# Altium schematic sheet Sheet.SchDoc
size A2
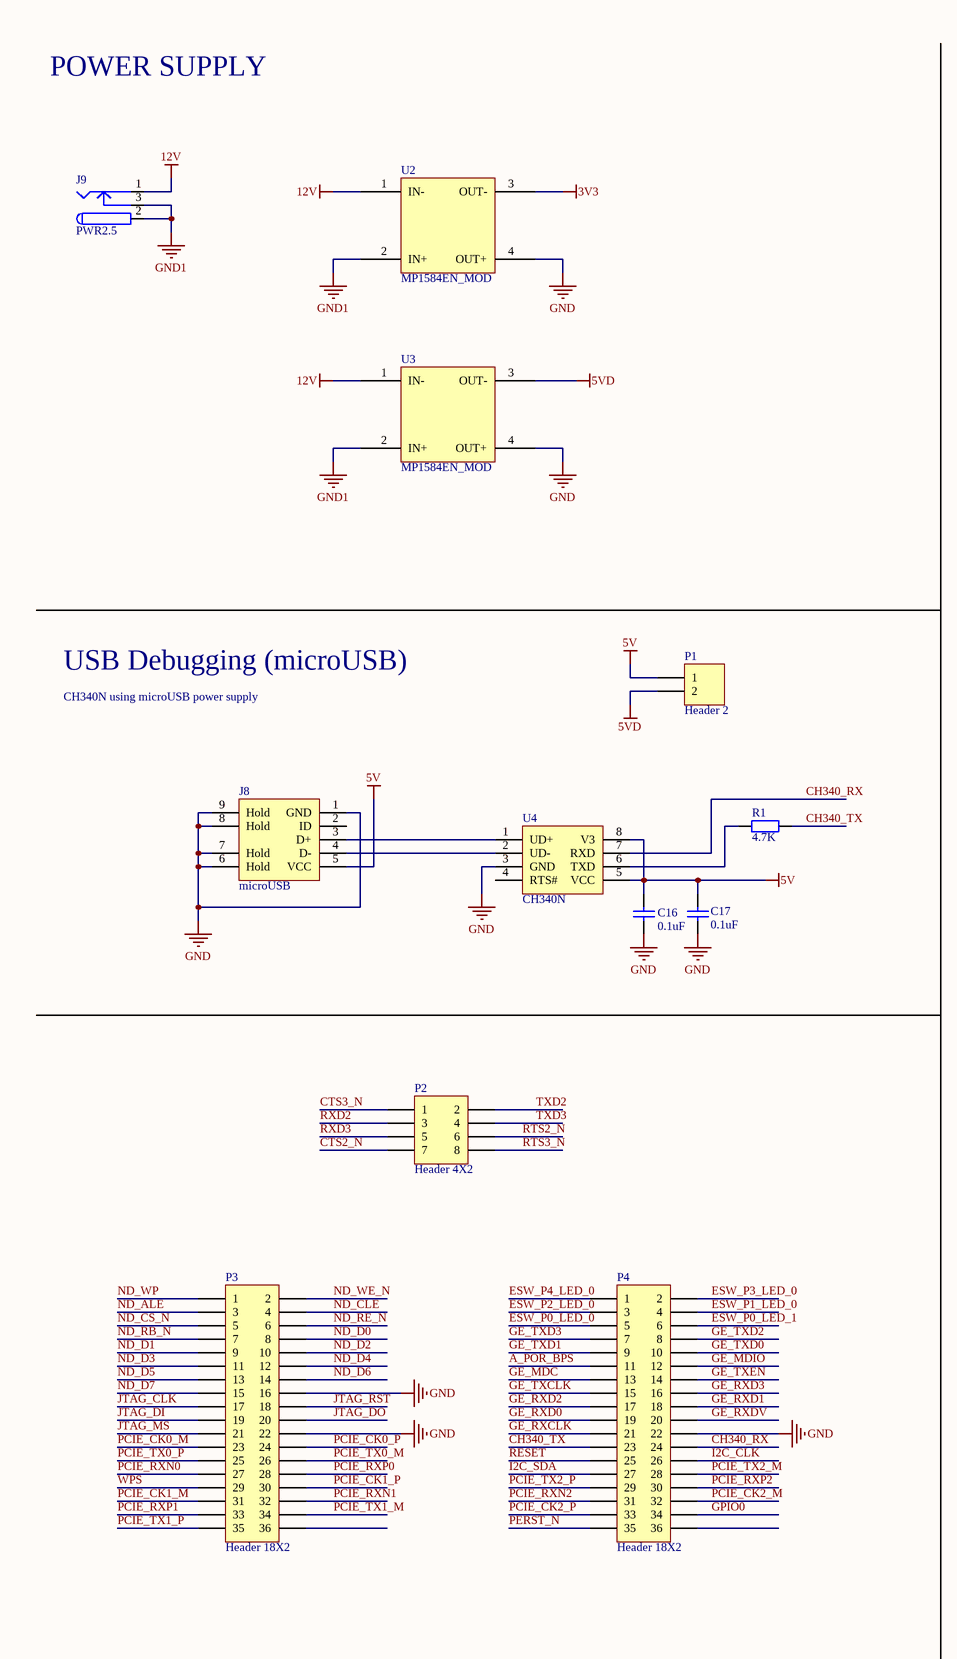
[diagram p0: Sheet.SchDoc, left]
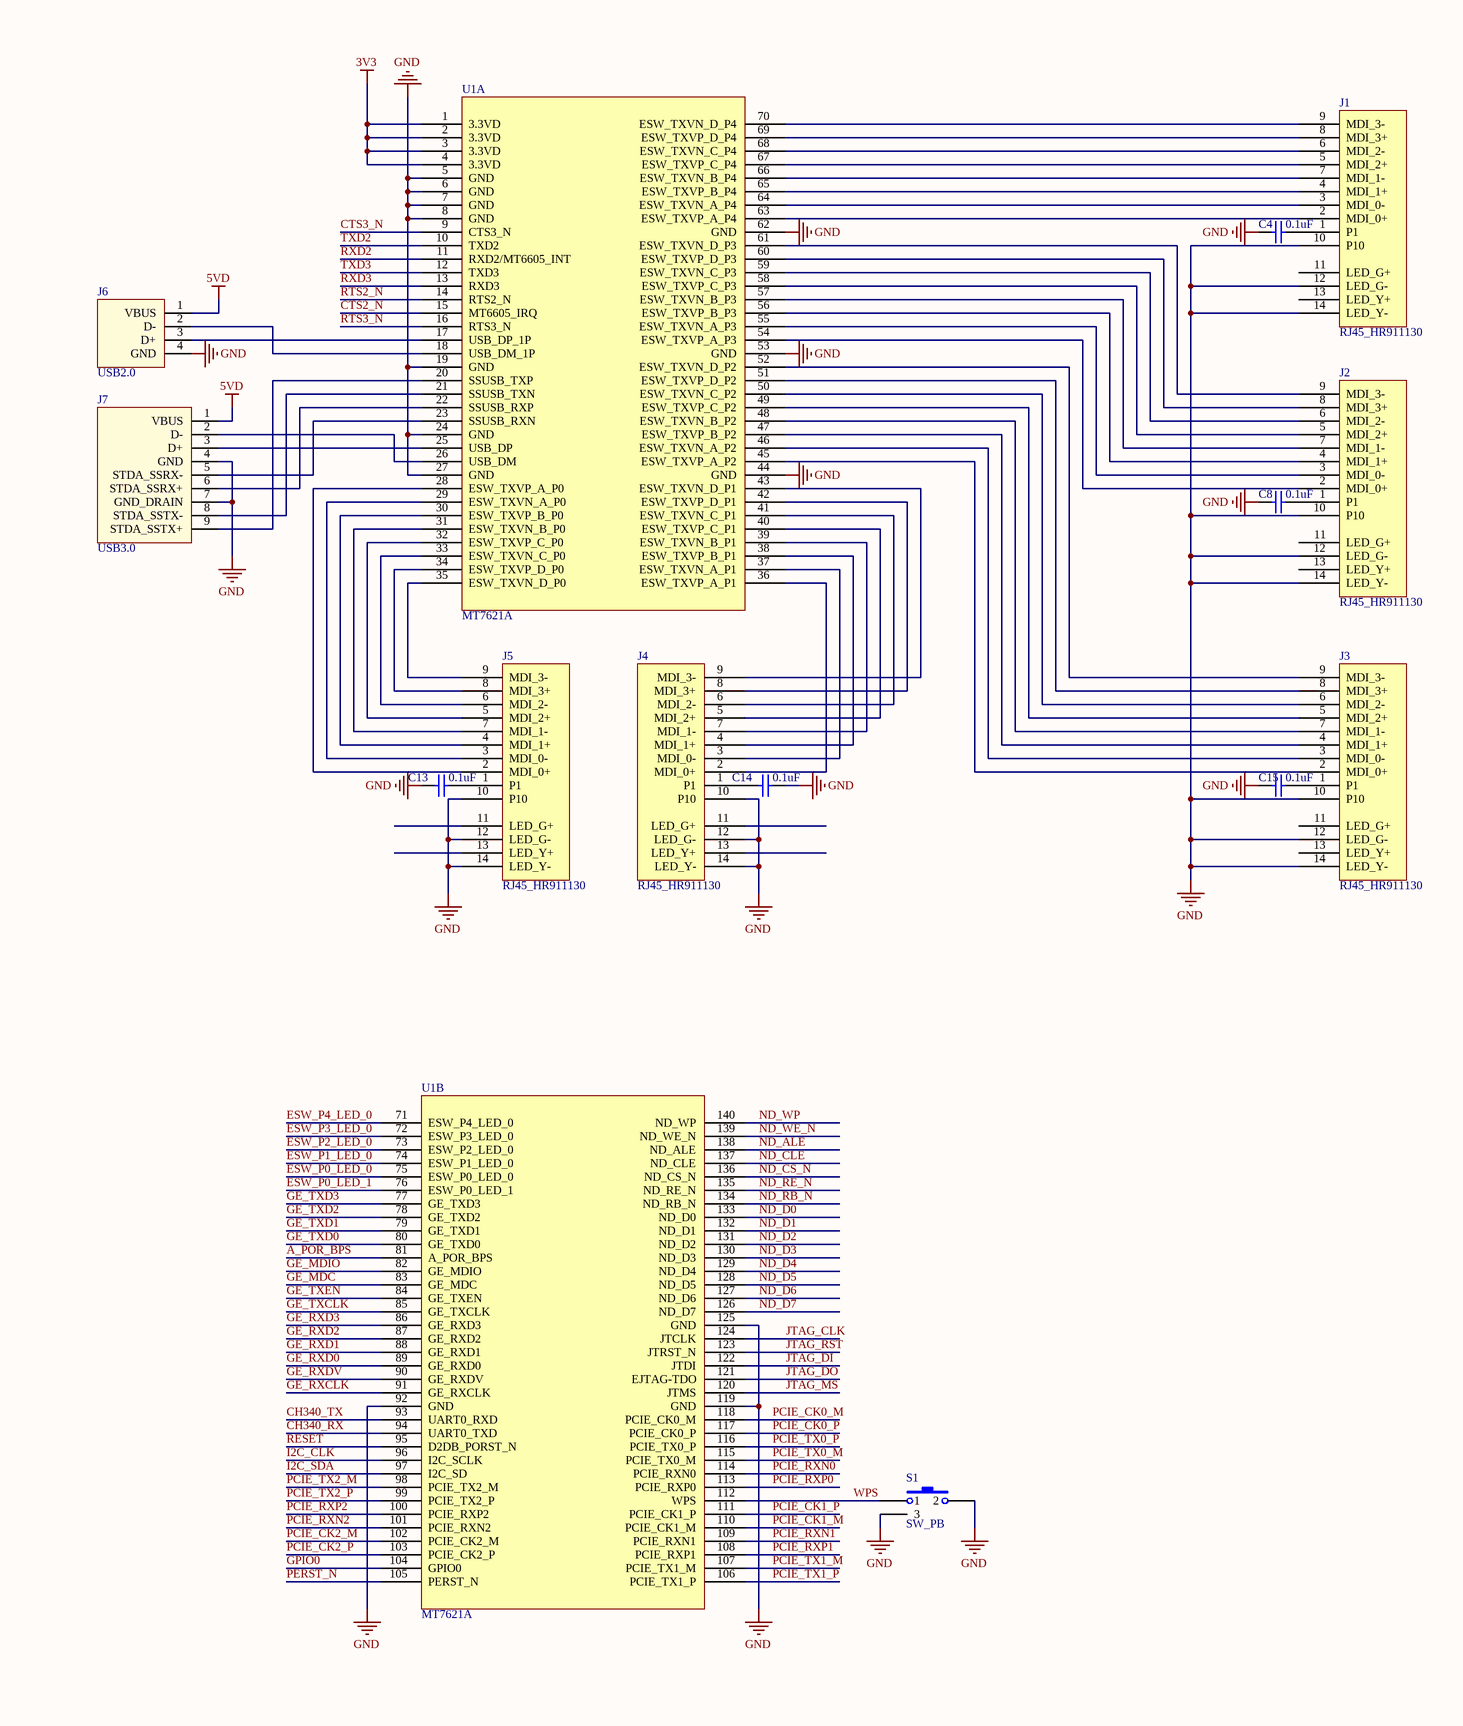
[diagram p1: Sheet.SchDoc, right]

## Parts
C4  value 0.1uF  [C0603]  (hidden comment: Cap)
C8  value 0.1uF  [C0603]  (hidden comment: Cap)
C13  value 0.1uF  [C0603]  (hidden comment: Cap)
C14  value 0.1uF  [C0603]  (hidden comment: Cap)
C15  value 0.1uF  [C0603]  (hidden comment: Cap)
C16  value 0.1uF  [C0603]  (hidden comment: Cap)
C17  value 0.1uF  [C0603]  (hidden comment: Cap)
J1  RJ45_HR911130  [RJ45_HR911130]
J2  RJ45_HR911130  [RJ45_HR911130]
J3  RJ45_HR911130  [RJ45_HR911130]
J4  RJ45_HR911130  [RJ45_HR911130]
J5  RJ45_HR911130  [RJ45_HR911130]
J6  USB2.0  [USB2.0]
J7  USB3.0  [USB3.0]
J8  microUSB  [MICROusb]
J9  PWR2.5  [CON\DC-JACK\4.7]
P1  Header 2  [HDR1X2]
P2  Header 4X2  [HDR2X4]
P3  Header 18X2  [HDR2X18]
P4  Header 18X2  [HDR2X18]
R1  value 4.7K  [3-0603]  (hidden comment: Res2)
S1  SW_PB  [SW_PB]
U1  MT7621A  [HLK-7621]  (parts A,B of 2)
U2  MP1584EN_MOD  [MP1584EN_MOD]
U3  MP1584EN_MOD  [MP1584EN_MOD]
U4  CH340N  [CH340N]

## Nets
3V3: U1.1(3.3VD) U1.2(3.3VD) U1.3(3.3VD) U1.4(3.3VD) U2.3(OUT-)
5V: C16.2 C17.1 J8.5(VCC) P1.1 U4.5(VCC) U4.8(V3)
5VD: J6.1(VBUS) J7.1(VBUS) P1.2 U3.3(OUT-)
12V: J9.1 U2.1(IN-) U3.1(IN-)
GND: C4.2 C8.2 C13.2 C14.1 C15.2 C16.1 C17.2 J1.10(P10) J1.12(LED_G-) J1.14(LED_Y-) J2.10(P10) J2.12(LED_G-) J2.14(LED_Y-) J3.10(P10) J3.12(LED_G-) J3.14(LED_Y-) J4.10(P10) J4.12(LED_G-) J4.14(LED_Y-) J5.10(P10) J5.12(LED_G-) J5.14(LED_Y-) J6.4(GND) J7.4(GND) J7.7(GND_DRAIN) J8.1(GND) J8.6(Hold) J8.7(Hold) J8.8(Hold) J8.9(Hold) P3.16 P3.22 P4.22 S1.2 S1.3 U1.5(GND) U1.6(GND) U1.7(GND) U1.8(GND) U1.19(GND) U1.24(GND) U1.27(GND) U1.44(GND) U1.53(GND) U1.62(GND) U1.92(GND) U1.119(GND) U1.125(GND) U2.4(OUT+) U3.4(OUT+) U4.3(GND)
GND1: J9.2 J9.3 U2.2(IN+) U3.2(IN+)
A_POR_BPS: P4.11 U1.81(A_POR_BPS)
CH340_RX: P4.24 U1.94(UART0_TXD) U4.7(RXD)
CH340_TX: P4.23 R1.1 U1.93(UART0_RXD)
CTS2_N: P2.7 U1.15(MT6605_IRQ)
CTS3_N: P2.1 U1.9(CTS3_N)
ESW_P0_LED_0: P4.5 U1.75(ESW_P0_LED_0)
ESW_P0_LED_1: P4.6 U1.76(ESW_P0_LED_1)
ESW_P1_LED_0: P4.4 U1.74(ESW_P1_LED_0)
ESW_P2_LED_0: P4.3 U1.73(ESW_P2_LED_0)
ESW_P3_LED_0: P4.2 U1.72(ESW_P3_LED_0)
ESW_P4_LED_0: P4.1 U1.71(ESW_P4_LED_0)
GE_MDC: P4.13 U1.83(GE_MDC)
GE_MDIO: P4.12 U1.82(GE_MDIO)
GE_RXCLK: P4.21 U1.91(GE_RXCLK)
GE_RXD0: P4.19 U1.89(GE_RXD0)
GE_RXD1: P4.18 U1.88(GE_RXD1)
GE_RXD2: P4.17 U1.87(GE_RXD2)
GE_RXD3: P4.16 U1.86(GE_RXD3)
GE_RXDV: P4.20 U1.90(GE_RXDV)
GE_TXCLK: P4.15 U1.85(GE_TXCLK)
GE_TXD0: P4.10 U1.80(GE_TXD0)
GE_TXD1: P4.9 U1.79(GE_TXD1)
GE_TXD2: P4.8 U1.78(GE_TXD2)
GE_TXD3: P4.7 U1.77(GE_TXD3)
GE_TXEN: P4.14 U1.84(GE_TXEN)
GPIO0: P4.34 U1.104(GPIO0)
I2C_CLK: P4.26 U1.96(I2C_SCLK)
I2C_SDA: P4.27 U1.97(I2C_SD)
JTAG_CLK: P3.17 U1.124(JTCLK)
JTAG_DI: P3.19 U1.122(JTDI)
JTAG_DO: P3.20 U1.121(EJTAG-TDO)
JTAG_MS: P3.21 U1.120(JTMS)
JTAG_RST: P3.18 U1.123(JTRST_N)
ND_ALE: P3.3 U1.138(ND_ALE)
ND_CLE: P3.4 U1.137(ND_CLE)
ND_CS_N: P3.5 U1.136(ND_CS_N)
ND_D0: P3.8 U1.133(ND_D0)
ND_D1: P3.9 U1.132(ND_D1)
ND_D2: P3.10 U1.131(ND_D2)
ND_D3: P3.11 U1.130(ND_D3)
ND_D4: P3.12 U1.129(ND_D4)
ND_D5: P3.13 U1.128(ND_D5)
ND_D6: P3.14 U1.127(ND_D6)
ND_D7: P3.15 U1.126(ND_D7)
ND_RB_N: P3.7 U1.134(ND_RB_N)
ND_RE_N: P3.6 U1.135(ND_RE_N)
ND_WE_N: P3.2 U1.139(ND_WE_N)
ND_WP: P3.1 U1.140(ND_WP)
PCIE_CK0_M: P3.23 U1.118(PCIE_CK0_M)
PCIE_CK0_P: P3.24 U1.117(PCIE_CK0_P)
PCIE_CK1_M: P3.31 U1.110(PCIE_CK1_M)
PCIE_CK1_P: P3.30 U1.111(PCIE_CK1_P)
PCIE_CK2_M: P4.32 U1.102(PCIE_CK2_M)
PCIE_CK2_P: P4.33 U1.103(PCIE_CK2_P)
PCIE_RXN0: P3.27 U1.114(PCIE_RXN0)
PCIE_RXN1: P3.32 U1.109(PCIE_RXN1)
PCIE_RXN2: P4.31 U1.101(PCIE_RXN2)
PCIE_RXP0: P3.28 U1.113(PCIE_RXP0)
PCIE_RXP1: P3.33 U1.108(PCIE_RXP1)
PCIE_RXP2: P4.30 U1.100(PCIE_RXP2)
PCIE_TX0_M: P3.26 U1.115(PCIE_TX0_M)
PCIE_TX0_P: P3.25 U1.116(PCIE_TX0_P)
PCIE_TX1_M: P3.34 U1.107(PCIE_TX1_M)
PCIE_TX1_P: P3.35 U1.106(PCIE_TX1_P)
PCIE_TX2_M: P4.28 U1.98(PCIE_TX2_M)
PCIE_TX2_P: P4.29 U1.99(PCIE_TX2_P)
PERST_N: P4.35 U1.105(PERST_N)
RESET: P4.25 U1.95(D2DB_PORST_N)
RTS2_N: P2.6 U1.14(RTS2_N)
RTS3_N: P2.8 U1.16(RTS3_N)
RXD2: P2.3 U1.11(RXD2/MT6605_INT)
RXD3: P2.5 U1.13(RXD3)
TXD2: P2.2 U1.10(TXD2)
TXD3: P2.4 U1.12(TXD3)
WPS: P3.29 S1.1 U1.112(WPS)
NetC4_1: C4.1 J1.1(P1)
NetC8_1: C8.1 J2.1(P1)
NetC13_1: C13.1 J5.1(P1)
NetC14_2: C14.2 J4.1(P1)
NetC15_1: C15.1 J3.1(P1)
NetJ1_2: J1.2(MDI_0+) U1.63(ESW_TXVP_A_P4)
NetJ1_3: J1.3(MDI_0-) U1.64(ESW_TXVN_A_P4)
NetJ1_4: J1.4(MDI_1+) U1.65(ESW_TXVP_B_P4)
NetJ1_5: J1.5(MDI_2+) U1.67(ESW_TXVP_C_P4)
NetJ1_6: J1.6(MDI_2-) U1.68(ESW_TXVN_C_P4)
NetJ1_7: J1.7(MDI_1-) U1.66(ESW_TXVN_B_P4)
NetJ1_8: J1.8(MDI_3+) U1.69(ESW_TXVP_D_P4)
NetJ1_9: J1.9(MDI_3-) U1.70(ESW_TXVN_D_P4)
NetJ2_2: J2.2(MDI_0+) U1.54(ESW_TXVP_A_P3)
NetJ2_3: J2.3(MDI_0-) U1.55(ESW_TXVN_A_P3)
NetJ2_4: J2.4(MDI_1+) U1.56(ESW_TXVP_B_P3)
NetJ2_5: J2.5(MDI_2+) U1.58(ESW_TXVP_C_P3)
NetJ2_6: J2.6(MDI_2-) U1.59(ESW_TXVN_C_P3)
NetJ2_7: J2.7(MDI_1-) U1.57(ESW_TXVN_B_P3)
NetJ2_8: J2.8(MDI_3+) U1.60(ESW_TXVP_D_P3)
NetJ2_9: J2.9(MDI_3-) U1.61(ESW_TXVN_D_P3)
NetJ3_2: J3.2(MDI_0+) U1.45(ESW_TXVP_A_P2)
NetJ3_3: J3.3(MDI_0-) U1.46(ESW_TXVN_A_P2)
NetJ3_4: J3.4(MDI_1+) U1.47(ESW_TXVP_B_P2)
NetJ3_5: J3.5(MDI_2+) U1.49(ESW_TXVP_C_P2)
NetJ3_6: J3.6(MDI_2-) U1.50(ESW_TXVN_C_P2)
NetJ3_7: J3.7(MDI_1-) U1.48(ESW_TXVN_B_P2)
NetJ3_8: J3.8(MDI_3+) U1.51(ESW_TXVP_D_P2)
NetJ3_9: J3.9(MDI_3-) U1.52(ESW_TXVN_D_P2)
NetJ4_2: J4.2(MDI_0+) U1.36(ESW_TXVP_A_P1)
NetJ4_3: J4.3(MDI_0-) U1.37(ESW_TXVN_A_P1)
NetJ4_4: J4.4(MDI_1+) U1.38(ESW_TXVP_B_P1)
NetJ4_5: J4.5(MDI_2+) U1.40(ESW_TXVP_C_P1)
NetJ4_6: J4.6(MDI_2-) U1.41(ESW_TXVN_C_P1)
NetJ4_7: J4.7(MDI_1-) U1.39(ESW_TXVN_B_P1)
NetJ4_8: J4.8(MDI_3+) U1.42(ESW_TXVP_D_P1)
NetJ4_9: J4.9(MDI_3-) U1.43(ESW_TXVN_D_P1)
NetJ5_2: J5.2(MDI_0+) U1.28(ESW_TXVP_A_P0)
NetJ5_3: J5.3(MDI_0-) U1.29(ESW_TXVN_A_P0)
NetJ5_4: J5.4(MDI_1+) U1.30(ESW_TXVP_B_P0)
NetJ5_5: J5.5(MDI_2+) U1.32(ESW_TXVP_C_P0)
NetJ5_6: J5.6(MDI_2-) U1.33(ESW_TXVN_C_P0)
NetJ5_7: J5.7(MDI_1-) U1.31(ESW_TXVN_B_P0)
NetJ5_8: J5.8(MDI_3+) U1.34(ESW_TXVP_D_P0)
NetJ5_9: J5.9(MDI_3-) U1.35(ESW_TXVN_D_P0)
NetJ6_2: J6.2(D-) U1.18(USB_DM_1P)
NetJ6_3: J6.3(D+) U1.17(USB_DP_1P)
NetJ7_2: J7.2(D-) U1.26(USB_DM)
NetJ7_3: J7.3(D+) U1.25(USB_DP)
NetJ7_5: J7.5(STDA_SSRX-) U1.23(SSUSB_RXN)
NetJ7_6: J7.6(STDA_SSRX+) U1.22(SSUSB_RXP)
NetJ7_8: J7.8(STDA_SSTX-) U1.21(SSUSB_TXN)
NetJ7_9: J7.9(STDA_SSTX+) U1.20(SSUSB_TXP)
NetJ8_3: J8.3(D+) U4.1(UD+)
NetJ8_4: J8.4(D-) U4.2(UD-)
NetR1_2: R1.2 U4.6(TXD)

Not connected (* = marked no-connect by the designer): J1 11(LED_G+) 13(LED_Y+); J2 11(LED_G+) 13(LED_Y+); J3 11(LED_G+) 13(LED_Y+); J4 11(LED_G+) 13(LED_Y+); J5 11(LED_G+) 13(LED_Y+); J8 2(ID); P3 36; P4 36; U4 4(RTS#)

## Notes on the sheet
- POWER SUPPLY
- USB Debugging (microUSB)
- CH340N using microUSB power supply

## Library data of the parts
C4 C8 C13-C17 = Cap: Capacitor; Published: 8-Jun-2000; LatestRevisionDate: 17-Jul-2002; LatestRevisionNote: Re-released for DXP Platform.; PackageReference: RAD-0.3; Publisher: Altium Limited; PackageDescription: Radial Cap, Thru-Hole; 2 Leads; 0.3 in Pin Spacing
P1 = Header 2: Header, 2-Pin; LatestRevisionDate: 17-Jul-2002; LatestRevisionNote: Re-released for DXP Platform.; Publisher: Altium Limited
P2 = Header 4X2: Header, 4-Pin, Dual row; LatestRevisionDate: 17-Jul-2002; LatestRevisionNote: Re-released for DXP Platform.; Publisher: Altium Limited
P3 P4 = Header 18X2: Header, 18-Pin, Dual row; LatestRevisionDate: 17-Jul-2002; LatestRevisionNote: Re-released for DXP Platform.; Publisher: Altium Limited
R1 = Res2: Resistor; Published: 8-Jun-2000; LatestRevisionDate: 17-Jul-2002; LatestRevisionNote: Re-released for DXP Platform.; PackageReference: AXIAL-0.4; Publisher: Altium Limited; PackageDescription: Axial Device, Thru-Hole; 2 Leads; 0.4 in Pin Spacing